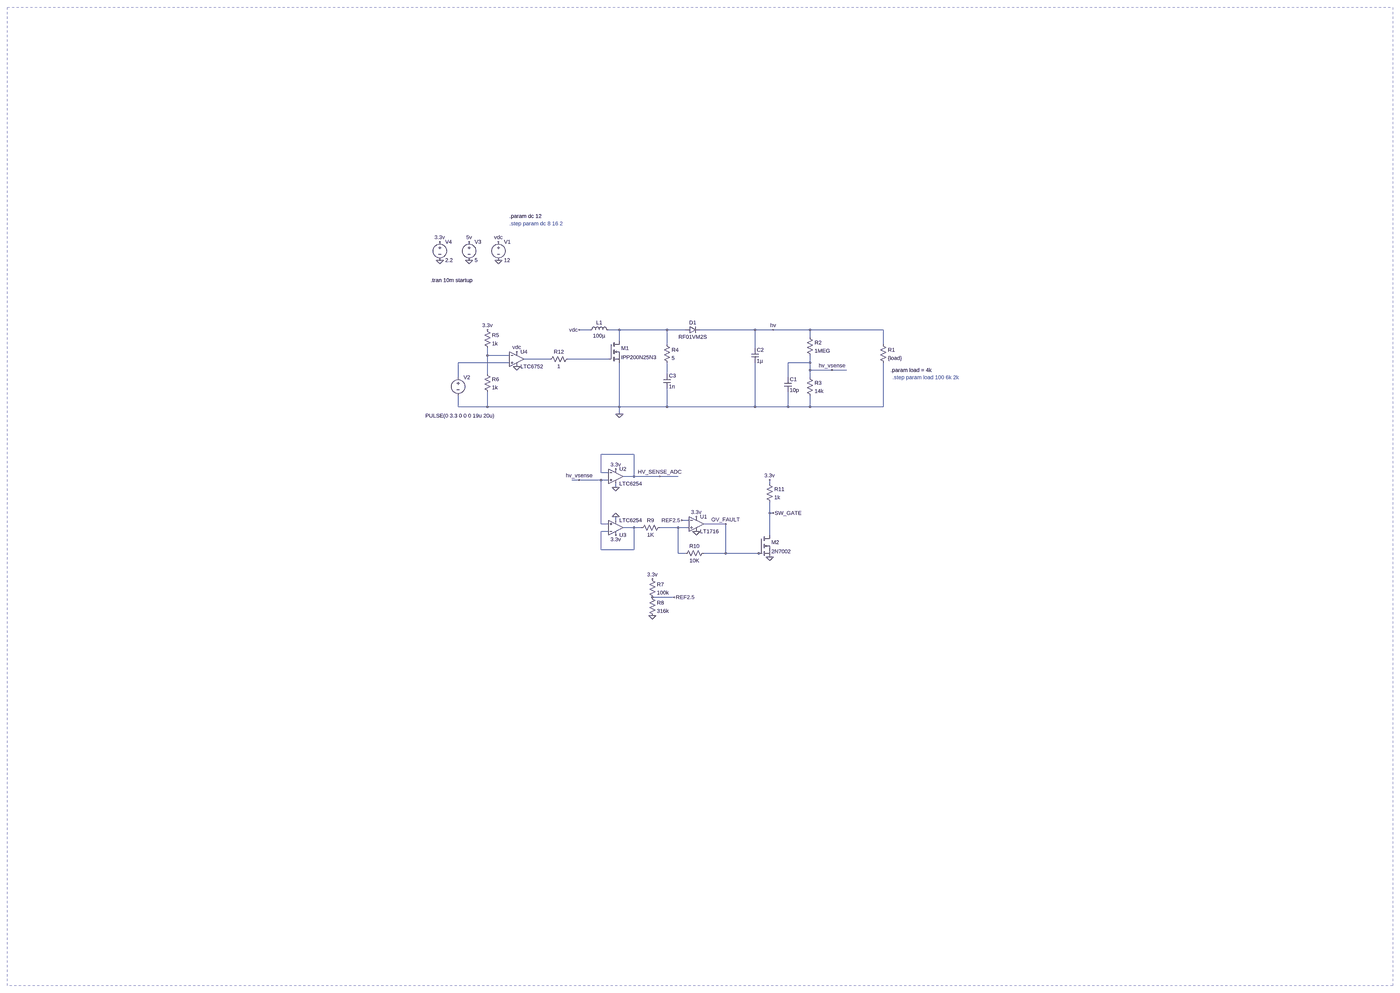
[diagram p0: schematic boost_converter.asc, whole sheet]
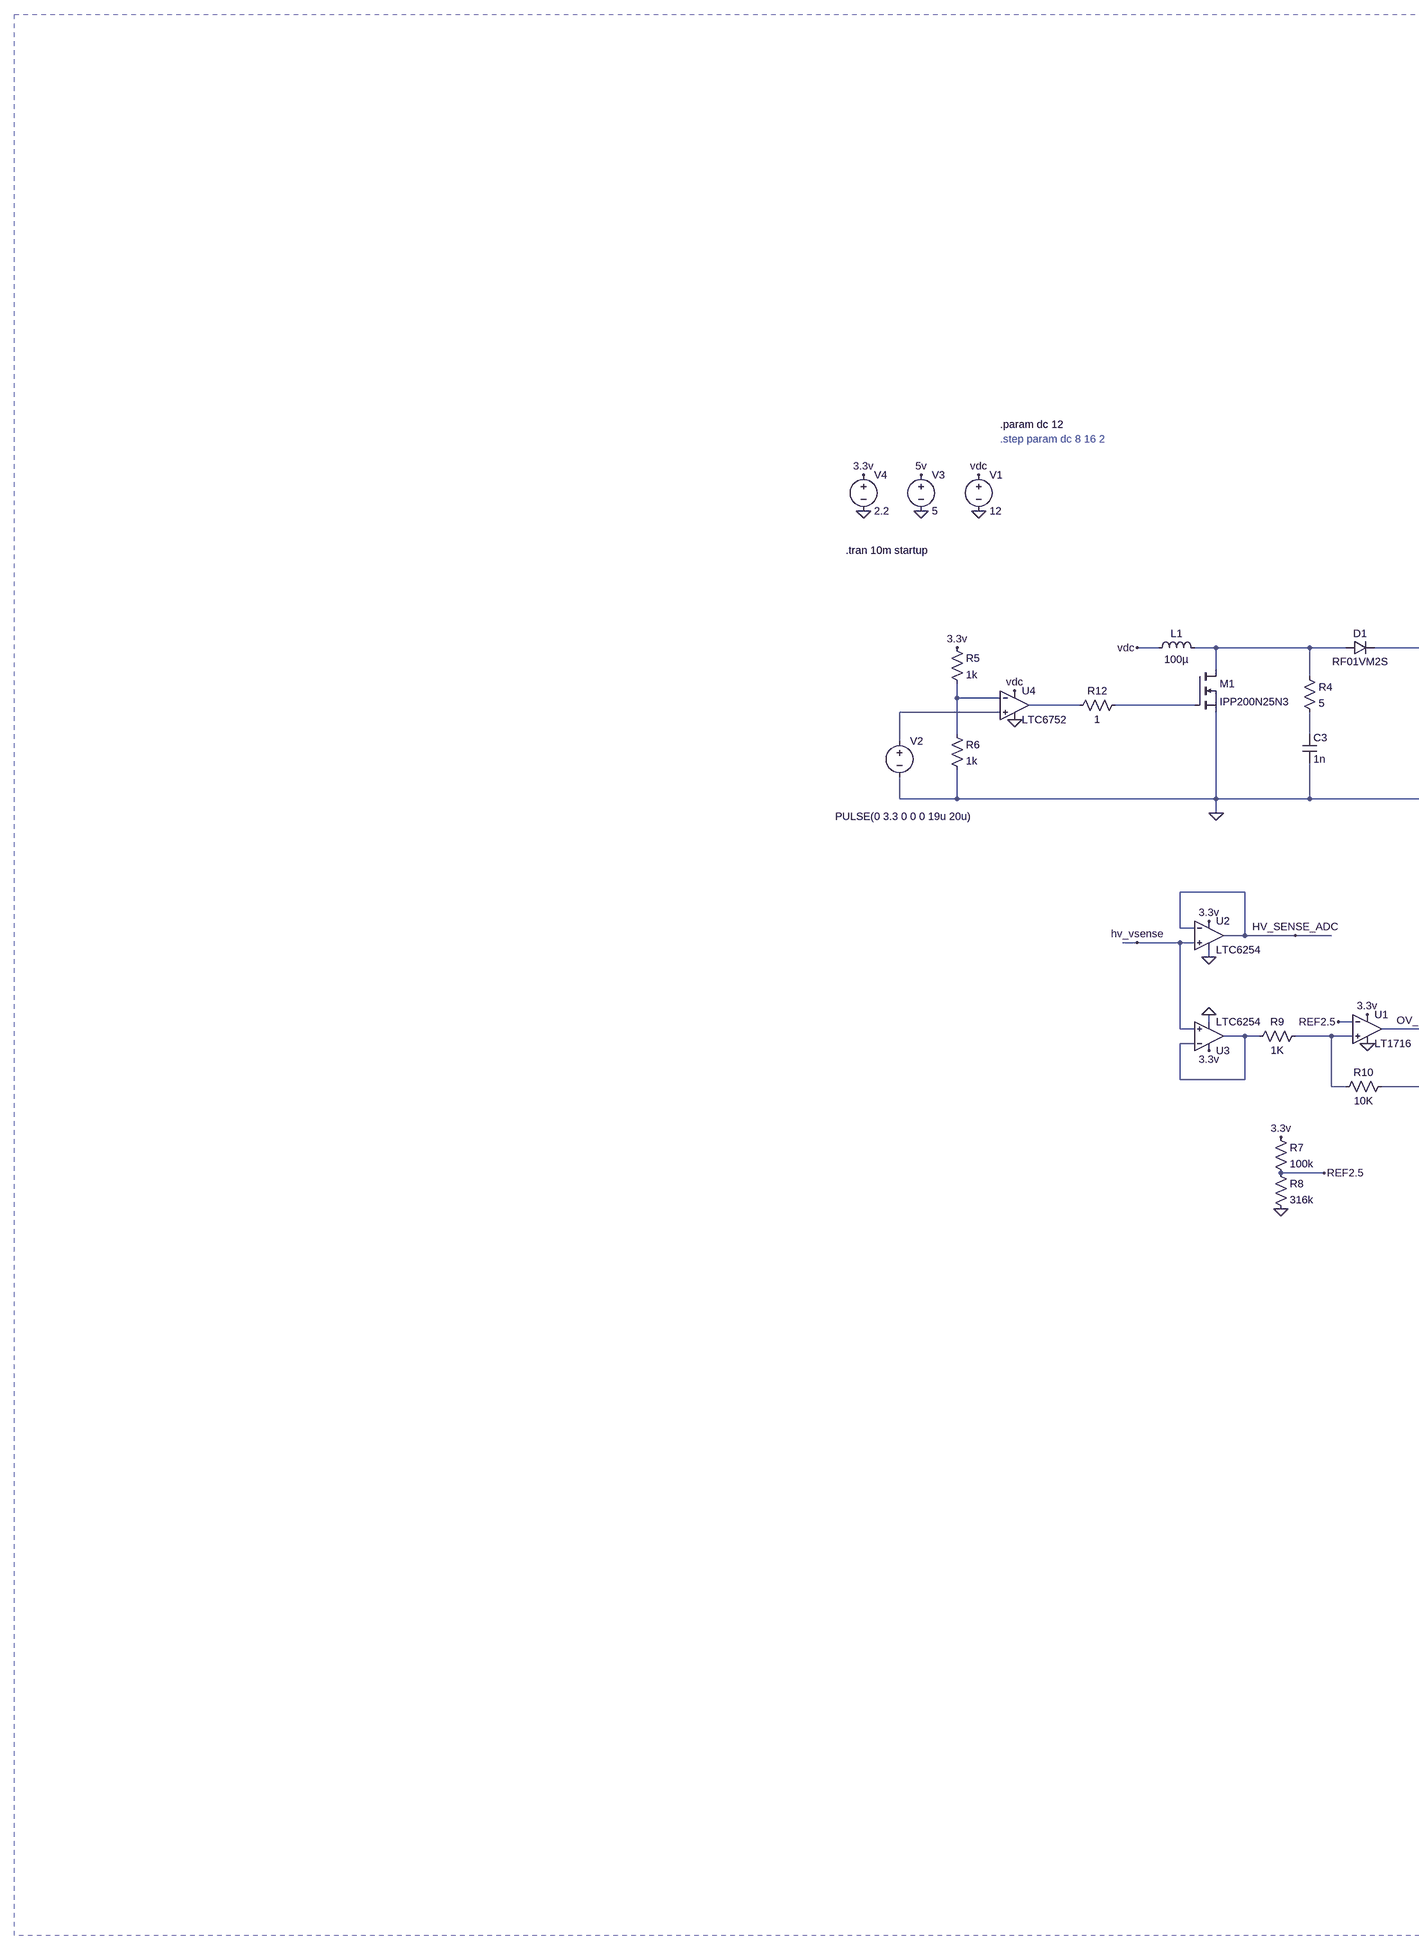
[diagram p1: schematic boost_converter.asc, part, row 1 of 1, column 1 of 2]
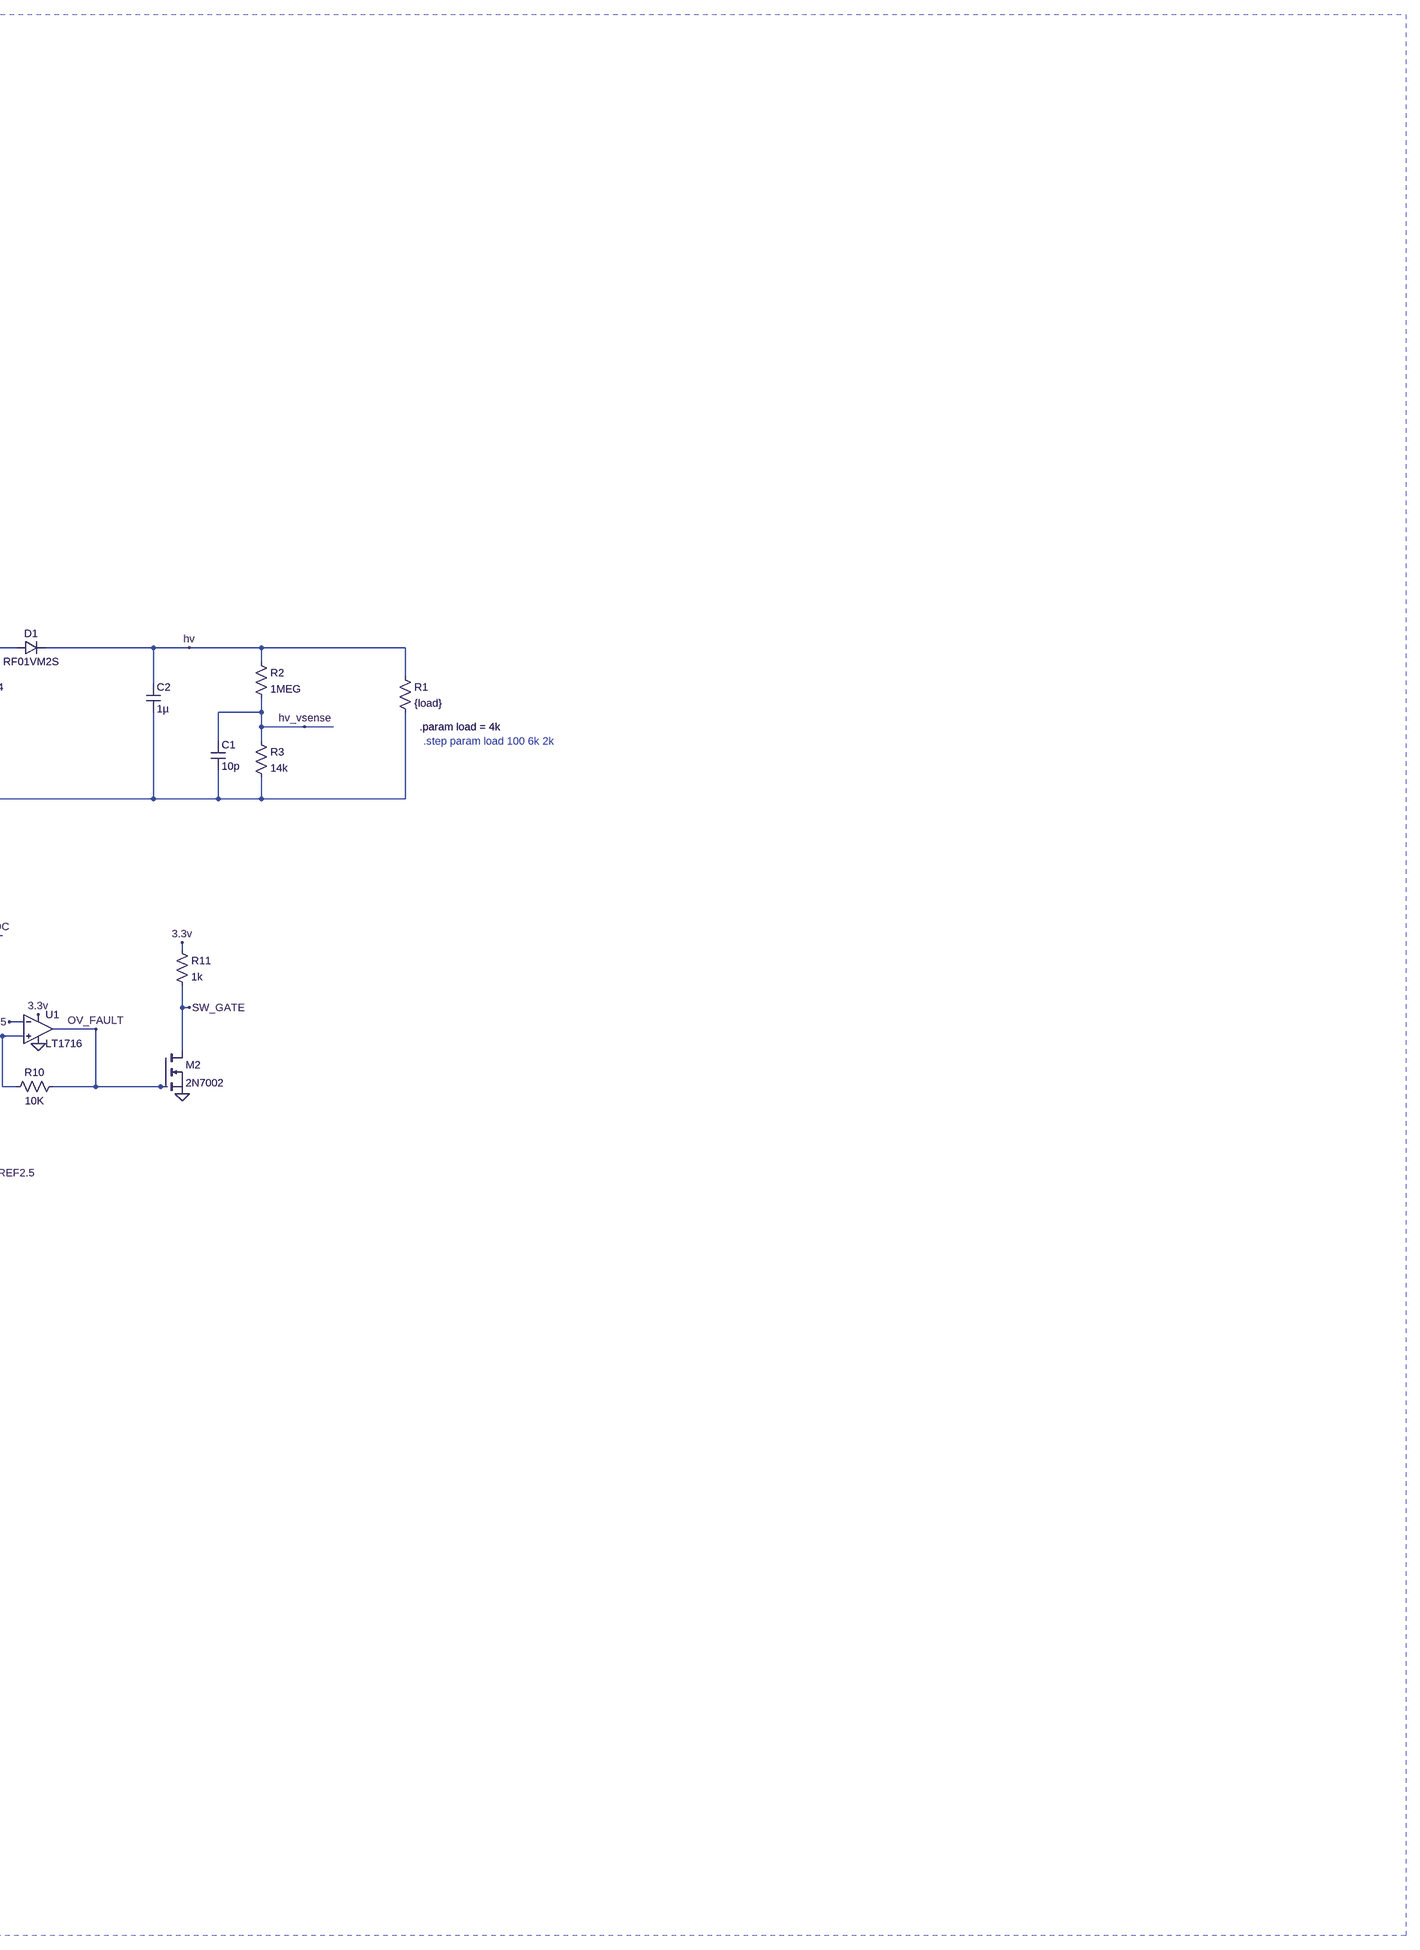
[diagram p2: schematic boost_converter.asc, part, row 1 of 1, column 2 of 2]
boost_converter.asc, the LTspice schematic file:
Version 4
SHEET 1 3460 3092
WIRE -48 224 -96 224
WIRE 80 224 32 224
WIRE 288 224 80 224
WIRE 368 224 288 224
WIRE 672 224 432 224
WIRE 752 224 672 224
WIRE 912 224 752 224
WIRE 1232 224 912 224
WIRE 912 256 912 224
WIRE 80 272 80 224
WIRE 288 288 288 224
WIRE 1232 288 1232 224
WIRE 672 304 672 224
WIRE -496 336 -496 304
WIRE -400 336 -496 336
WIRE -224 352 -336 352
WIRE 32 352 -144 352
WIRE -400 368 -624 368
WIRE 912 368 912 336
WIRE 912 368 816 368
WIRE 912 400 912 368
WIRE 1008 400 912 400
WIRE 1072 400 1008 400
WIRE -496 416 -496 336
WIRE 288 416 288 368
WIRE -624 432 -624 368
WIRE 816 432 816 368
WIRE 912 432 912 400
WIRE -624 560 -624 512
WIRE -496 560 -496 496
WIRE -496 560 -624 560
WIRE 80 560 80 368
WIRE 80 560 -496 560
WIRE 288 560 288 480
WIRE 288 560 80 560
WIRE 672 560 672 368
WIRE 672 560 288 560
WIRE 816 560 816 496
WIRE 816 560 672 560
WIRE 912 560 912 512
WIRE 912 560 816 560
WIRE 1232 560 1232 368
WIRE 1232 560 912 560
WIRE 80 592 80 560
WIRE 144 768 0 768
WIRE 0 848 0 768
WIRE 32 848 0 848
WIRE 144 864 144 768
WIRE 144 864 96 864
WIRE 256 864 144 864
WIRE 336 864 256 864
WIRE -96 880 -128 880
WIRE 0 880 -96 880
WIRE 32 880 0 880
WIRE 736 896 736 880
WIRE 64 912 64 896
WIRE 736 1024 736 976
WIRE 752 1024 736 1024
WIRE 64 1056 64 1040
WIRE 384 1056 352 1056
WIRE 0 1072 0 880
WIRE 32 1072 0 1072
WIRE 544 1072 448 1072
WIRE 144 1088 96 1088
WIRE 176 1088 144 1088
WIRE 336 1088 256 1088
WIRE 384 1088 336 1088
WIRE 32 1104 0 1104
WIRE 736 1120 736 1024
WIRE 0 1184 0 1104
WIRE 144 1184 144 1088
WIRE 144 1184 0 1184
WIRE 336 1200 336 1088
WIRE 368 1200 336 1200
WIRE 544 1200 544 1072
WIRE 544 1200 448 1200
WIRE 688 1200 544 1200
WIRE 704 1200 688 1200
WIRE 320 1392 224 1392
FLAG -96 224 vdc
FLAG -448 -160 vdc
FLAG -448 -80 0
FLAG 80 592 0
FLAG 752 224 hv
FLAG 1008 400 hv_vsense
FLAG -576 -160 5v
FLAG -576 -80 0
FLAG -704 -160 3.3v
FLAG -704 -80 0
FLAG 64 832 3.3v
FLAG 64 1120 3.3v
FLAG 64 912 0
FLAG 64 1040 0
FLAG 256 864 HV_SENSE_ADC
FLAG 224 1312 3.3v
FLAG 224 1472 0
FLAG 320 1392 REF2.5
FLAG 416 1040 3.3v
FLAG 416 1104 0
FLAG 544 1072 OV_FAULT
FLAG 352 1056 REF2.5
FLAG 736 880 3.3v
FLAG 736 1216 0
FLAG 752 1024 SW_GATE
FLAG -96 880 hv_vsense
FLAG -368 320 vdc
FLAG -368 384 0
FLAG -496 224 3.3v
SYMBOL ind -64 240 R270
WINDOW 0 32 56 VTop 2
WINDOW 3 5 56 VBottom 2
SYMATTR InstName L1
SYMATTR Value 100µ
SYMATTR SpiceLine Ipk=2 Rser=170u
SYMBOL voltage -448 -176 R0
WINDOW 123 0 0 Left 2
WINDOW 39 0 0 Left 2
SYMATTR InstName V1
SYMATTR Value 12
SYMBOL nmos 32 272 R0
SYMATTR InstName M1
SYMATTR Value IPP200N25N3
SYMBOL diode 368 240 R270
WINDOW 0 32 32 VTop 2
WINDOW 3 0 32 VBottom 2
SYMATTR InstName D1
SYMATTR Value RF01VM2S
SYMBOL cap 656 304 R0
SYMATTR InstName C2
SYMATTR Value 1µ
SYMBOL voltage -624 416 R0
WINDOW 123 0 0 Left 2
WINDOW 39 0 0 Left 2
WINDOW 3 -143 183 Left 2
SYMATTR Value PULSE(0 3.3 0 0 0 19u 20u)
SYMATTR InstName V2
SYMBOL res 1216 272 R0
SYMATTR InstName R1
SYMATTR Value {load}
SYMBOL res 896 240 R0
SYMATTR InstName R2
SYMATTR Value 1MEG
SYMBOL res 896 416 R0
SYMATTR InstName R3
SYMATTR Value 14k
SYMBOL cap 800 432 R0
SYMATTR InstName C1
SYMATTR Value 10p
SYMBOL voltage -576 -176 R0
WINDOW 123 0 0 Left 2
WINDOW 39 0 0 Left 2
SYMATTR InstName V3
SYMATTR Value 5
SYMBOL voltage -704 -176 R0
WINDOW 123 0 0 Left 2
WINDOW 39 0 0 Left 2
SYMATTR InstName V4
SYMATTR Value 2.2
SYMBOL res 272 272 R0
SYMATTR InstName R4
SYMATTR Value 5
SYMBOL cap 272 416 R0
SYMATTR InstName C3
SYMATTR Value 1n
SYMBOL res 208 1296 R0
SYMATTR InstName R7
SYMATTR Value 100k
SYMBOL res 208 1376 R0
SYMATTR InstName R8
SYMATTR Value 316k
SYMBOL Comparators\\LT1716 416 1072 R0
SYMATTR InstName U1
SYMBOL res 272 1072 R90
WINDOW 0 0 56 VBottom 2
WINDOW 3 32 56 VTop 2
SYMATTR InstName R9
SYMATTR Value 1K
SYMBOL res 464 1184 R90
WINDOW 0 0 56 VBottom 2
WINDOW 3 32 56 VTop 2
SYMATTR InstName R10
SYMATTR Value 10K
SYMBOL nmos 688 1120 R0
SYMATTR InstName M2
SYMATTR Value 2N7002
SYMBOL res 720 880 R0
SYMATTR InstName R11
SYMATTR Value 1k
SYMBOL Opamps\\LTC6254 64 864 R0
SYMATTR InstName U2
SYMBOL Opamps\\LTC6254 64 1088 M180
SYMATTR InstName U3
SYMBOL res -512 208 R0
SYMATTR InstName R5
SYMATTR Value 1k
SYMBOL res -512 400 R0
SYMATTR InstName R6
SYMATTR Value 1k
SYMBOL Comparators\\LTC6752 -368 288 R0
SYMATTR InstName U4
SYMBOL res -128 336 R90
WINDOW 0 0 56 VBottom 2
WINDOW 3 32 56 VTop 2
SYMATTR InstName R12
SYMATTR Value 1
TEXT -400 -272 Left 2 !.param dc 12
TEXT -400 -240 Left 2 ;.step param dc 8 16 2
TEXT -744 8 Left 2 !.tran 10m startup
TEXT 1264 400 Left 2 !.param load = 4k
TEXT 1272 432 Left 2 ;.step param load 100 6k 2k
RECTANGLE Normal 3456 3088 -2592 -1184 2

The netlist it stands for:
* boost_converter.asc
L1 vdc N001 100µ Ipk=2 Rser=170u
V1 vdc 0 12
M1 N001 N004 0 0 IPP200N25N3
D1 N001 hv RF01VM2S
C2 hv 0 1µ
V2 N005 0 PULSE(0 3.3 0 0 0 19u 20u)
R1 hv 0 {load}
R2 hv hv_vsense 1MEG
R3 hv_vsense 0 14k
C1 hv_vsense 0 10p
V3 5v 0 5
V4 3.3v 0 2.2
R4 N001 N006 5
C3 N006 0 1n
R7 3.3v REF2.5 100k
R8 REF2.5 0 316k
XU1 N008 REF2.5 3.3v 0 OV_FAULT LT1716  ; pins In+ In- V+ V- OUT
R9 N008 N007 1K
R10 OV_FAULT N008 10K
M2 SW_GATE OV_FAULT 0 0 2N7002
R11 3.3v SW_GATE 1k
* U2: LTC6254 (symbol Opamps\LTC6254 not available, pins judged from their places): In+=hv_vsense In-=HV_SENSE_ADC V+=3.3v V-=0 OUT=HV_SENSE_ADC
* U3: LTC6254 (symbol Opamps\LTC6254 not available, pins judged from their places): In+=hv_vsense In-=N007 V+=3.3v V-=0 OUT=N007
R5 3.3v N002 1k
R6 N002 0 1k
XU4 N005 N002 vdc 0 N003 LTC6752  ; pins In+ In- V+ V- OUT
R12 N004 N003 1
.model D D
.lib standard.dio
.model NMOS NMOS
.model PMOS PMOS
.lib standard.mos
.param dc 12
* .step param dc 8 16 2
.tran 10m startup
.param load = 4k
* .step param load 100 6k 2k
.lib LTC1.lib
.lib LTC7.lib
.backanno
.end